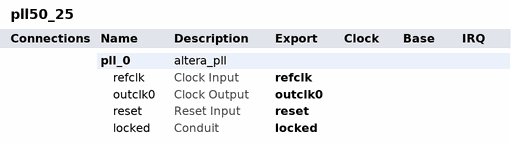
[diagram p0: system contents]
# Platform Designer (Qsys) system pll50_25, Cyclone V 5CSXFC6D6F31C6
# Parameters at their usual value, and those the tool derives, are not listed.
package require -exact qsys 22.1
create_system pll50_25
set_project_property DEVICE_FAMILY {Cyclone V}
set_project_property DEVICE 5CSXFC6D6F31C6

add_instance pll_0 altera_pll 22.1
set_instance_property pll_0 AUTO_EXPORT true
set_instance_parameter_value pll_0 gui_device_speed_grade 1
set_instance_parameter_value pll_0 gui_number_of_clocks 1
set_instance_parameter_value pll_0 gui_operation_mode direct
set_instance_parameter_value pll_0 gui_output_clock_frequency0 25.0
set_instance_parameter_value pll_0 gui_pll_mode {Integer-N PLL}
set_instance_parameter_value pll_0 gui_reference_clock_frequency 50.0
set_instance_parameter_value pll_0 gui_use_locked true

# exported interfaces
add_interface locked conduit end
set_interface_property locked EXPORT_OF pll_0.locked
add_interface outclk0 clock source
set_interface_property outclk0 EXPORT_OF pll_0.outclk0
add_interface refclk clock sink
set_interface_property refclk EXPORT_OF pll_0.refclk
add_interface reset reset sink
set_interface_property reset EXPORT_OF pll_0.reset

set_interconnect_requirement {$system} qsys_mm.clockCrossingAdapter HANDSHAKE
set_interconnect_requirement {$system} qsys_mm.enableEccProtection FALSE
set_interconnect_requirement {$system} qsys_mm.insertDefaultSlave FALSE
set_interconnect_requirement {$system} qsys_mm.maxAdditionalLatency 1

save_system pll50_25.qsys
